# EAGLE design DAC_OutputStage 4 (EAGLE 9.6.2)
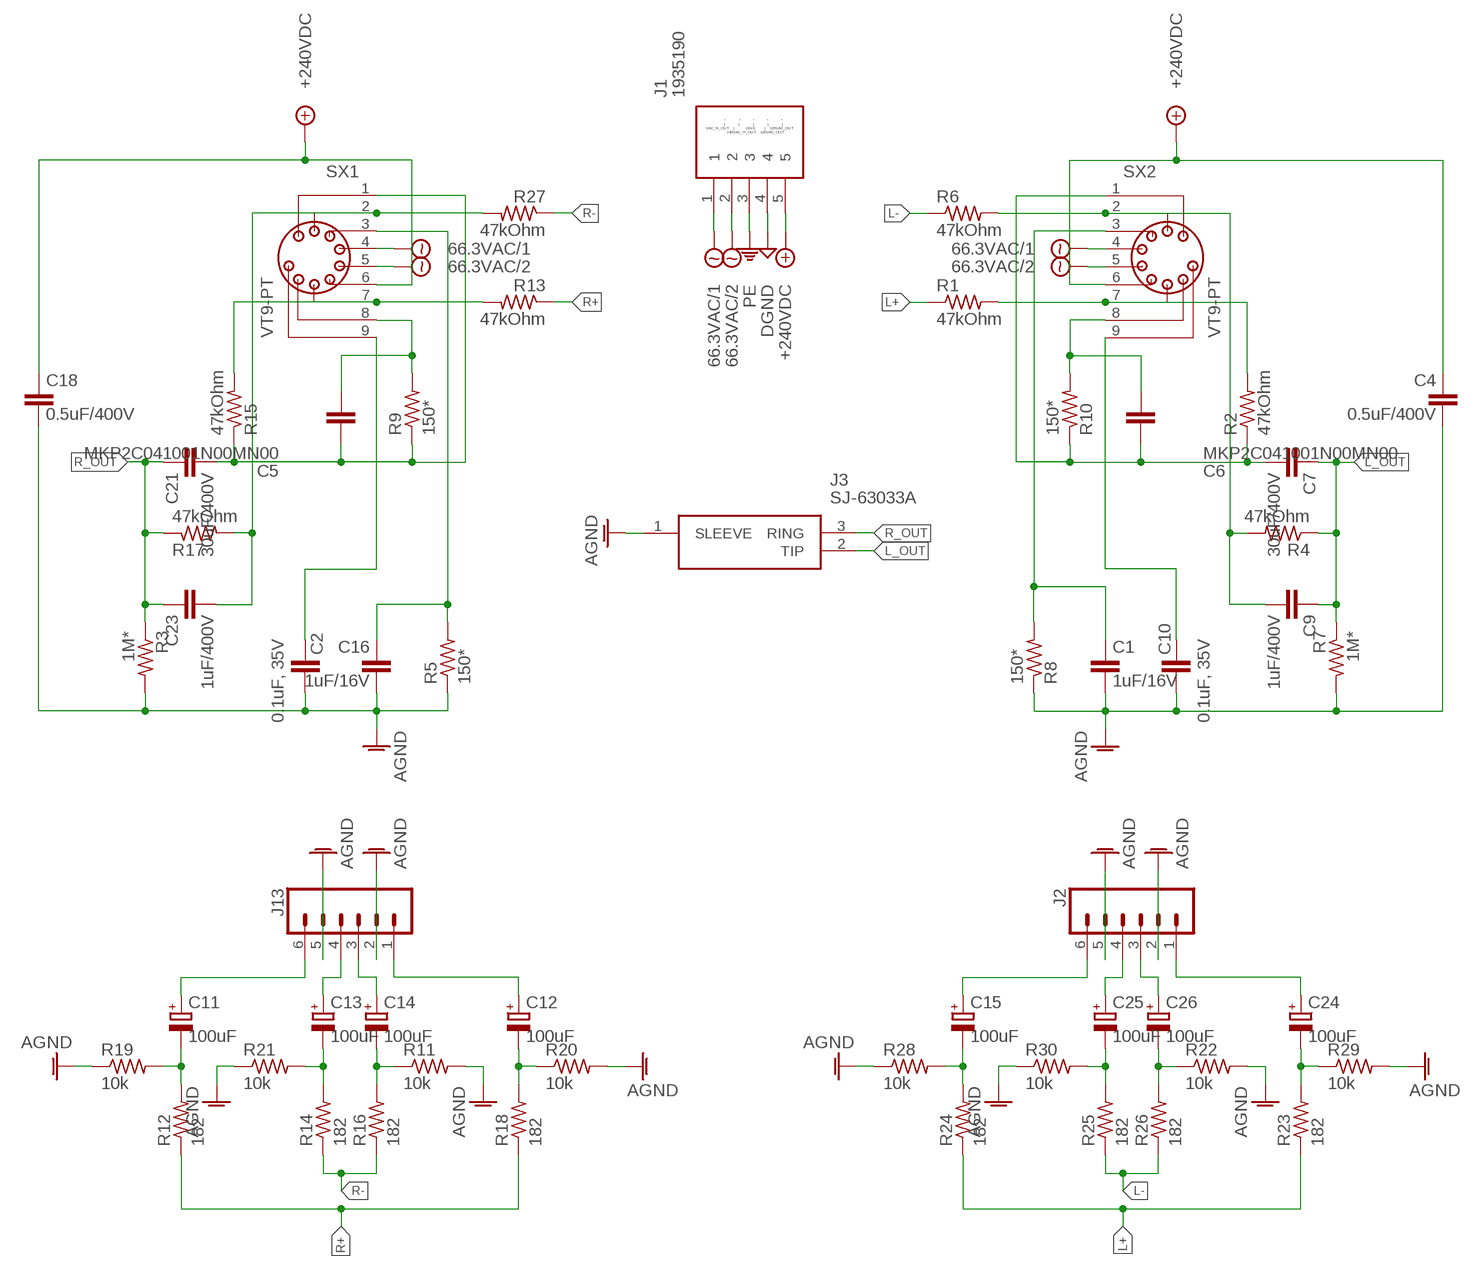
[diagram p0: schematic, sheet 1]

## Parts
C1  1uF/16V  MKP2C041001N00MN00  [MKP2C041001N00MN00]
C2  0.1uF, 35V  MKS4B031002A00JC00  [MKS4B031002A00JC00]
C4  0.5uF/400V  MKP4G034705D00KSSD  [MKP4G034705D00KSSD]
C5  MKP2C041001N00MN00  [MKP2C041001N00MN00]
C6  MKP2C041001N00MN00  [MKP2C041001N00MN00]
C7  30uF/400V  DCP4G053006ID2KSSD  [DCP4G053006ID2KSSD]
C9  1uF/400V  MKP4G041005I00JSSD  [MKP4G041005I00JSSD]
C10  0.1uF, 35V  MKS4B031002A00JC00  [MKS4B031002A00JC00]
C11  100uF  UFW1H101MPD1TD  [CAPPRD350W60D825H1300]
C12  100uF  UFW1H101MPD1TD  [CAPPRD350W60D825H1300]
C13  100uF  UFW1H101MPD1TD  [CAPPRD350W60D825H1300]
C14  100uF  UFW1H101MPD1TD  [CAPPRD350W60D825H1300]
C15  100uF  UFW1H101MPD1TD  [CAPPRD350W60D825H1300]
C16  1uF/16V  MKP2C041001N00MN00  [MKP2C041001N00MN00]
C18  0.5uF/400V  MKP4G034705D00KSSD  [MKP4G034705D00KSSD]
C21  30uF/400V  DCP4G053006ID2KSSD  [DCP4G053006ID2KSSD]
C23  1uF/400V  MKP4G041005I00JSSD  [MKP4G041005I00JSSD]
C24  100uF  UFW1H101MPD1TD  [CAPPRD350W60D825H1300]
C25  100uF  UFW1H101MPD1TD  [CAPPRD350W60D825H1300]
C26  100uF  UFW1H101MPD1TD  [CAPPRD350W60D825H1300]
J1  1935190  [1935190]
J2  CONN_06SILK_FEMALE_PTH  [1X06]
J3  SJ-63033A  [SJ63033A]
J13  CONN_06SILK_FEMALE_PTH  [1X06]
R1  47kOhm  LR1F47K  [RESAD1540W55L620D230]
R2  47kOhm  LR1F47K  [RESAD1540W55L620D230]
R3  1M*  LR1F1M0  [RESAD1540W60L620D230]
R4  47kOhm  LR1F47K  [RESAD1540W55L620D230]
R5  150*  LR1F150R  [RESAD1540W55L620D230]
R6  47kOhm  LR1F47K  [RESAD1540W55L620D230]
R7  1M*  LR1F1M0  [RESAD1540W60L620D230]
R8  150*  LR1F150R  [RESAD1540W55L620D230]
R9  150*  LR1F150R  [RESAD1540W55L620D230]
R10  150*  LR1F150R  [RESAD1540W55L620D230]
R11  10k  LR1F10K  [RESAD1540W55L620D230]
R12  182  MF0207FTE52-182R  [RESAD1590W60L630D240]
R13  47kOhm  LR1F47K  [RESAD1540W55L620D230]
R14  182  MF0207FTE52-182R  [RESAD1590W60L630D240]
R15  47kOhm  LR1F47K  [RESAD1540W55L620D230]
R16  182  MF0207FTE52-182R  [RESAD1590W60L630D240]
R17  47kOhm  LR1F47K  [RESAD1540W55L620D230]
R18  182  MF0207FTE52-182R  [RESAD1590W60L630D240]
R19  10k  LR1F10K  [RESAD1540W55L620D230]
R20  10k  LR1F10K  [RESAD1540W55L620D230]
R21  10k  LR1F10K  [RESAD1540W55L620D230]
R22  10k  LR1F10K  [RESAD1540W55L620D230]
R23  182  MF0207FTE52-182R  [RESAD1590W60L630D240]
R24  182  MF0207FTE52-182R  [RESAD1590W60L630D240]
R25  182  MF0207FTE52-182R  [RESAD1590W60L630D240]
R26  182  MF0207FTE52-182R  [RESAD1590W60L630D240]
R27  47kOhm  LR1F47K  [RESAD1540W55L620D230]
R28  10k  LR1F10K  [RESAD1540W55L620D230]
R29  10k  LR1F10K  [RESAD1540W55L620D230]
R30  10k  LR1F10K  [RESAD1540W55L620D230]
SX1  VT9-PT  [VT9-PT]
SX2  VT9-PT  [VT9-PT]

## Nets
66.3VAC/1: J1.1 SX1.4 SX2.4
66.3VAC/2: J1.2 SX1.5 SX2.5
+240VDC: C4.1 C18.1 J1.5 SX1.6 SX2.6
AGND [Power]: C1.2 C2.2 C4.2 C10.2 C16.2 C18.2 J2.2 J2.5 J3.1(SLEEVE) J13.2 J13.5 R3.2 R5.1 R7.2 R8.1 R11.2 R19.1 R20.2 R21.1 R22.2 R28.1 R29.2 R30.1
DGND: J1.4
L+: R1.1 R23.1 R24.1
L-: R6.1 R25.1 R26.1
L_OUT: C7.1 C9.1 J3.2(TIP) R4.1 R7.1
N$1: C5.2 R9.2 SX1.8
N$2: C2.1 SX1.9
N$3: R1.2 R2.2 SX2.7
N$4: C6.2 R10.2 SX2.8
N$5: C6.1 C7.2 R2.1 R10.1 SX2.1
N$7: C9.2 R4.2 R6.2 SX2.2
N$8: C1.1 R8.2 SX2.3
N$9: C10.1 SX2.9
N$10: C11.1(+) J13.6
N$11: C11.2(-) R12.2 R19.2
N$12: C15.1(+) J2.6
N$15: C12.1(+) J13.1
N$16: R13.2 R15.2 SX1.7
N$18: C5.1 C21.2 R9.1 R15.1 SX1.1
N$19: C12.2(-) R18.2 R20.1
N$20: C15.2(-) R24.2 R28.2
N$21: C13.1(+) J13.4
N$23: C23.2 R17.2 R27.2 SX1.2
N$24: C14.1(+) J13.3
N$25: C14.2(-) R11.1 R16.2
N$26: C16.1 R5.2 SX1.3
N$28: C13.2(-) R14.2 R21.2
N$30: C24.1(+) J2.1
N$31: C24.2(-) R23.2 R29.1
N$32: C25.1(+) J2.4
N$33: C26.1(+) J2.3
N$34: C26.2(-) R22.1 R26.2
N$36: C25.2(-) R25.2 R30.2
PE: J1.3
R+: R12.1 R13.1 R18.1
R-: R14.1 R16.1 R27.1
R_OUT: C21.1 C23.1 J3.3(RING) R3.1 R17.1

## Notes on the sheet
- ^             ^            ^            ^            ^
          |             |             |             |             |
  VAC_N_OUT    |           GND         |    126VAC_OUT
              240VAC_H_OUT    126VAC_OUT

## Library data of the parts
C1 C5 C6 C16 = Dual Mono Amp Library:MKP2C041001N00MN00: Film Capacitors MKP 2 1.0 uF 63 VDC 11x16x7.2 PCM 5 Source: Datasheet; DESCRIPTION: Film Capacitors MKP 2 1.0 uF 63 VDC 11x16x7.2 PCM 5; HEIGHT: 16mm; MANUFACTURER_NAME: WIMA; MANUFACTURER_PART_NUMBER: MKP2C041001N00MN00; MOUSER_PART_NUMBER: 505-MKP2C0411NMN; MOUSER_PRICE-STOCK: https://www.mouser.co.uk/ProductDetail/WIMA/MKP2C041001N00MN00?qs=RB4whv9F6rzjnMhXY4f0hA%3D%3D
C2 C10 = Dual Mono Amp Library:MKS4B031002A00JC00: Film Capacitors MKS 4 0.1 uF 50 VDC 2.5x7x10 PCM 7.5 Source: Datasheet <https://www.wima.de/wp-content/uploads/media/e_WIMA_MKS_4.pdf>; DESCRIPTION: Film Capacitors MKS 4 0.1 uF 50 VDC 2.5x7x10 PCM 7.5; HEIGHT: 7mm; MANUFACTURER_NAME: WIMA; MANUFACTURER_PART_NUMBER: MKS4B031002A00JC00; MOUSER_PART_NUMBER: 505-MKS4B0312AJC; MOUSER_PRICE-STOCK: https://www.mouser.co.uk/ProductDetail/WIMA/MKS4B031002A00JC00?qs=2G4irm%2FqADy9MV8AUfKNYA%3D%3D
C4 C18 = Dual Mono Amp Library:MKP4G034705D00KSSD: 0.47 F Film Capacitor 220V 400V Polypropylene (PP), Metallized Radial Source: Datasheet <https://www.wima.de/wp-content/uploads/media/e_WIMA_MKP_4.pdf>; DESCRIPTION: 0.47 F Film Capacitor 220V 400V Polypropylene (PP), Metallized Radial; HEIGHT: 16.5mm; MANUFACTURER_NAME: WIMA; MANUFACTURER_PART_NUMBER: MKP4G034705D00KSSD; MOUSER_PART_NUMBER: 505-MKP4G034705DKSSD; MOUSER_PRICE-STOCK: http://www.mouser.com/Search/ProductDetail.aspx?qs=sJjjjplDs9uaOctv9bTMfA%3d%3d
C7 C21 = Dual Mono Amp Library:DCP4G053006ID2KSSD: Film Capacitors DC-LINK MKP 4 30.0 uF 400 VDC 17x34.5x31.5 PCM 27.5 Source: Datasheet <https://www.wima.de/wp-content/uploads/media/e_WIMA_DC_Link_MKP_4.pdf>; DESCRIPTION: Film Capacitors DC-LINK MKP 4 30.0 uF 400 VDC 17x34.5x31.5 PCM 27.5; HEIGHT: 34.5mm; MANUFACTURER_NAME: WIMA; MANUFACTURER_PART_NUMBER: DCP4G053006ID2KSSD; MOUSER_PART_NUMBER: 505-DCP4G0536ID2KSSD; MOUSER_PRICE-STOCK: https://www.mouser.co.uk/ProductDetail/WIMA/DCP4G053006ID2KSSD?qs=RB4whv9F6rwxZ2Ey0tRejg%3D%3D
C9 C23 = Dual Mono Amp Library:MKP4G041005I00JSSD: Film Capacitors 1uF 400 Volts 5% Source: Datasheet <https://www.wima.de/wp-content/uploads/media/e_WIMA_MKP_4.pdf>; DESCRIPTION: Film Capacitors 1uF 400 Volts 5%; HEIGHT: 21mm; MANUFACTURER_NAME: WIMA; MANUFACTURER_PART_NUMBER: MKP4G041005I00JSSD; MOUSER_PART_NUMBER: 505-MKP4G041005I00JS; MOUSER_PRICE-STOCK: https://www.mouser.co.uk/ProductDetail/WIMA/MKP4G041005I00JSSD?qs=JZ%252BiKJYxjZXJVyWNRtSklQ%3D%3D
C11-C15 C24-C26 = Dual Mono Amp Library:UFW1H101MPD1TD: Aluminum Electrolytic Capacitors - Radial Leaded 100uF 50 Volts 20% Source: Datasheet <https://www.nichicon.co.jp/english/series_items/catalog_pdf/e-ufw.pdf>; ARROW_PART_NUMBER: UFW1H101MPD1TD; ARROW_PRICE-STOCK: https://www.arrow.com/en/products/ufw1h101mpd1td/nichicon; DESCRIPTION: Aluminum Electrolytic Capacitors - Radial Leaded 100uF 50 Volts 20%; HEIGHT: 13mm; MANUFACTURER_NAME: Nichicon; MANUFACTURER_PART_NUMBER: UFW1H101MPD1TD; MOUSER_PART_NUMBER: 647-UFW1H101MPD1TD; MOUSER_PRICE-STOCK: https://www.mouser.co.uk/ProductDetail/Nichicon/UFW1H101MPD1TD?qs=WJSLByB5Mu30jPPJ2KiG3A%3D%3D
J1 = Dual Mono Amp Library:1935190: PCB terminal block, nominal current: 17.5 A, rated voltage (III/2): 400 V, nominal cross section: 1.5 mm?, Number of potentials: 5, Number of rows: 1, Number of positions per row: 5, product range: PT 1,5/..-H, pitch: 5 mm, connection method: Screw connection with wire protector, mounting: Wave soldering, conductor/PCB connection direction: 0 ?, color: green, Pin layout: Linear pinning, Solder pin [P]: 3.5 mm, type of packaging: packed in cardboard Source: Datasheet <https://www.phoenixcontact.com/online/portal/us/pxc/product_detail_page/!ut/p/z1/3Vdbc5pAFP4r5sG3rLsLLEJn-oDGlJjEYsQqvDDssma24RZETf31Xbyk1Wn1IeN0CnNm2D2c853L8jEc6MMp9NNwKZ7DUmRpGMu95-uB23F7PUfR8dch6aC7G9LtPWhP2B4o8Bv0oV-GFHq4WsWCFmHxA3qLOU8rRS4i-chUCTZRtc>; DESCRIPTION: PCB terminal block, nominal current: 17.5 A, rated voltage (III/2): 400 V, nominal cross section: 1.5 mm?, Number of potentials: 5, Number of rows: 1, Number of positions per row: 5, product range: PT 1,5/..-H, pitch: 5 mm, connection method: Screw connection with wire protector, mounting: Wave soldering, conductor/PCB connection direction: 0 ?, color: green, Pin layout: Linear pinning, Solder pin [P]: 3.5 mm, type of packaging: packed in cardboard; HEIGHT: 11.55mm; MANUFACTURER_NAME: Phoenix Contact; MANUFACTURER_PART_NUMBER: 1935190; MOUSER_PART_NUMBER: 651-1935190; MOUSER_PRICE-STOCK: https://www.mouser.co.uk/ProductDetail/Phoenix-Contact/1935190?qs=QWULklcAmSS%2FS46GSzyZOw%3D%3D
J2 J13 = Dual Mono Amp Library:CONN_06: Multi connection point. Often used as Generic Header-pin footprint for 0.1 inch spaced/style header connections On any of the 0.1 inch spaced packages, you can populate with these: Break Away Headers - Straight <https://www.sparkfun.com/products/116> (PRT-00116) Break Away Male Headers - Right Angle <https://www.sparkfun.com/products/553> (PRT-00553) Female Headers <https://www.sparkfun.com/products/115> (PRT-00115) Break Away Headers - Machine Pin <https://www.sparkfun.com/products/117> (PRT-00117) Break Away Female Headers - Swiss Machine Pin <https://www.sparkfun.com/products/743> (PRT-00743) Arduino Stackable Header - 6 Pin <https://www.sparkfun.com/products/9280> (PRT-09280) Screw Terminals 2.54mm Pitch (6-Pin) <https://www.sparkfun.com/products/16499> (PRT-16499) For SCREWTERMINALS and SPRING TERMINALS visit here: Screw Terimnals on SparkFun.com <https://www.sparkfun.com/search/results?term=Screw+Terminals> (5mm/3.5mm/2.54mm spacing) This device is also useful as a general connection point to wire up your design to another part of your project. Our various solder wires solder well into these plated through hole pads. Hook-Up Wire - Assortment (Stranded, 22 AWG) <https://www.sparkfun.com/products/11375> (PRT-11375) Hook-Up Wire - Assortment (Solid Core, 22 AWG) <https://www.sparkfun.com/products/11367> (PRT-11367) View the entire wire category on our website here <https://www.sparkfun.com/categories/141>; PROD_ID: CONN-08437
J3 = Dual Mono Amp Library:SJ-63033A: 6.35 mm, Stereo, Right Angle, Through Hole Mount, 3 Conductors, 0 Internal Switches, Audio Jack Connector Source: Datasheet <https://www.cuidevices.com/product/resource/sj-63033a.pdf>; DESCRIPTION: 6.35 mm, Stereo, Right Angle, Through Hole Mount, 3 Conductors, 0 Internal Switches, Audio Jack Connector; HEIGHT: 12.3mm; MANUFACTURER_NAME: CUI Devices; MANUFACTURER_PART_NUMBER: SJ-63033A
R1 R2 R4 R6 R13 R15 R17 R27 = Dual Mono Amp Library:LR1F47K: TE Connectivity LR1F Series Axial Metal Film Resistor 47k +/-1% 0.6W +/-50ppm/C Source: Datasheet <https://componentsearchengine.com/Datasheets/2/LR1F47K.pdf>; DESCRIPTION: TE Connectivity LR1F Series Axial Metal Film Resistor 47k +/-1% 0.6W +/-50ppm/C; HEIGHT: mm; MANUFACTURER_NAME: TE Connectivity; MANUFACTURER_PART_NUMBER: LR1F47K; MOUSER_PART_NUMBER: 279-LR1F47K; MOUSER_PRICE-STOCK: https://www.mouser.co.uk/ProductDetail/TE-Connectivity-Holsworthy/LR1F47K?qs=ip69W3eHERWQ8q3y81tH5w%3D%3D
R3 R7 = Dual Mono Amp Library:LR1F1M0: TE Connectivity Axial Metal Film Resistor 1m +/-1% 0.6W +/-50ppm/C Source: Datasheet <https://www.te.com/commerce/DocumentDelivery/DDEController?Action=showdoc&DocId=Data Sheet1773241GpdfEnglishENG_DS_1773241_G.pdf1622367-1>; DESCRIPTION: TE Connectivity Axial Metal Film Resistor 1m +/-1% 0.6W +/-50ppm/C; HEIGHT: mm; MANUFACTURER_NAME: TE Connectivity; MANUFACTURER_PART_NUMBER: LR1F1M0; MOUSER_PART_NUMBER: 279-LR1F1M0; MOUSER_PRICE-STOCK: https://www.mouser.co.uk/ProductDetail/TE-Connectivity-Holsworthy/LR1F1M0?qs=ip69W3eHERVt%2FmQVAugcSg%3D%3D
R5 R8-R10 = Dual Mono Amp Library:LR1F150R: TE Connectivity LR1F Series Axial Metal Film Resistor 150 +/-1% 0.6W +/-50ppm/C Source: Datasheet <https://datasheet.datasheetarchive.com/originals/distributors/DKDS-21/401716.pdf>; DESCRIPTION: TE Connectivity LR1F Series Axial Metal Film Resistor 150 +/-1% 0.6W +/-50ppm/C; HEIGHT: mm; MANUFACTURER_NAME: TE Connectivity; MANUFACTURER_PART_NUMBER: LR1F150R
R11 R19-R22 R28-R30 = Dual Mono Amp Library:LR1F10K: Metal film resistor, 10K 0.6W TE Connectivity LR1F Series Axial Metal Film Resistor 10k Source: Datasheet <https://datasheet.datasheetarchive.com/originals/distributors/DKDS-21/401716.pdf>; DESCRIPTION: Metal film resistor, 10K 0.6W TE Connectivity LR1F Series Axial Metal Film Resistor 10k; HEIGHT: mm; MANUFACTURER_NAME: TE Connectivity; MANUFACTURER_PART_NUMBER: LR1F10K; MOUSER_PART_NUMBER: 279-LR1F10K; MOUSER_PRICE-STOCK: https://www.mouser.co.uk/ProductDetail/TE-Connectivity-Holsworthy/LR1F10K?qs=ip69W3eHERWDLLWs2Qv0Lg%3D%3D
R12 R14 R16 R18 R23-R26 = Dual Mono Amp Library:MF0207FTE52-182R: Metal Film Resistors - Through Hole 0.6W 1% 182 ohm 50pp m Source: Datasheet <https://www.mouser.com/datasheet/2/447/YAGEO_MF0_datasheet_2021v1-3003020.pdf>; DESCRIPTION: Metal Film Resistors - Through Hole 0.6W 1% 182 ohm 50pp m; HEIGHT: mm; MANUFACTURER_NAME: YAGEO; MANUFACTURER_PART_NUMBER: MF0207FTE52-182R
SX1 SX2 = Dual Mono Amp Library:VT9: VACUUM TUBE SOCKET Source: 00004280-VT9-PT.pdf

## Net classes
3 Power: width 1.27 mm, drill 1.27 mm, clearance 0.254 mm

## Board
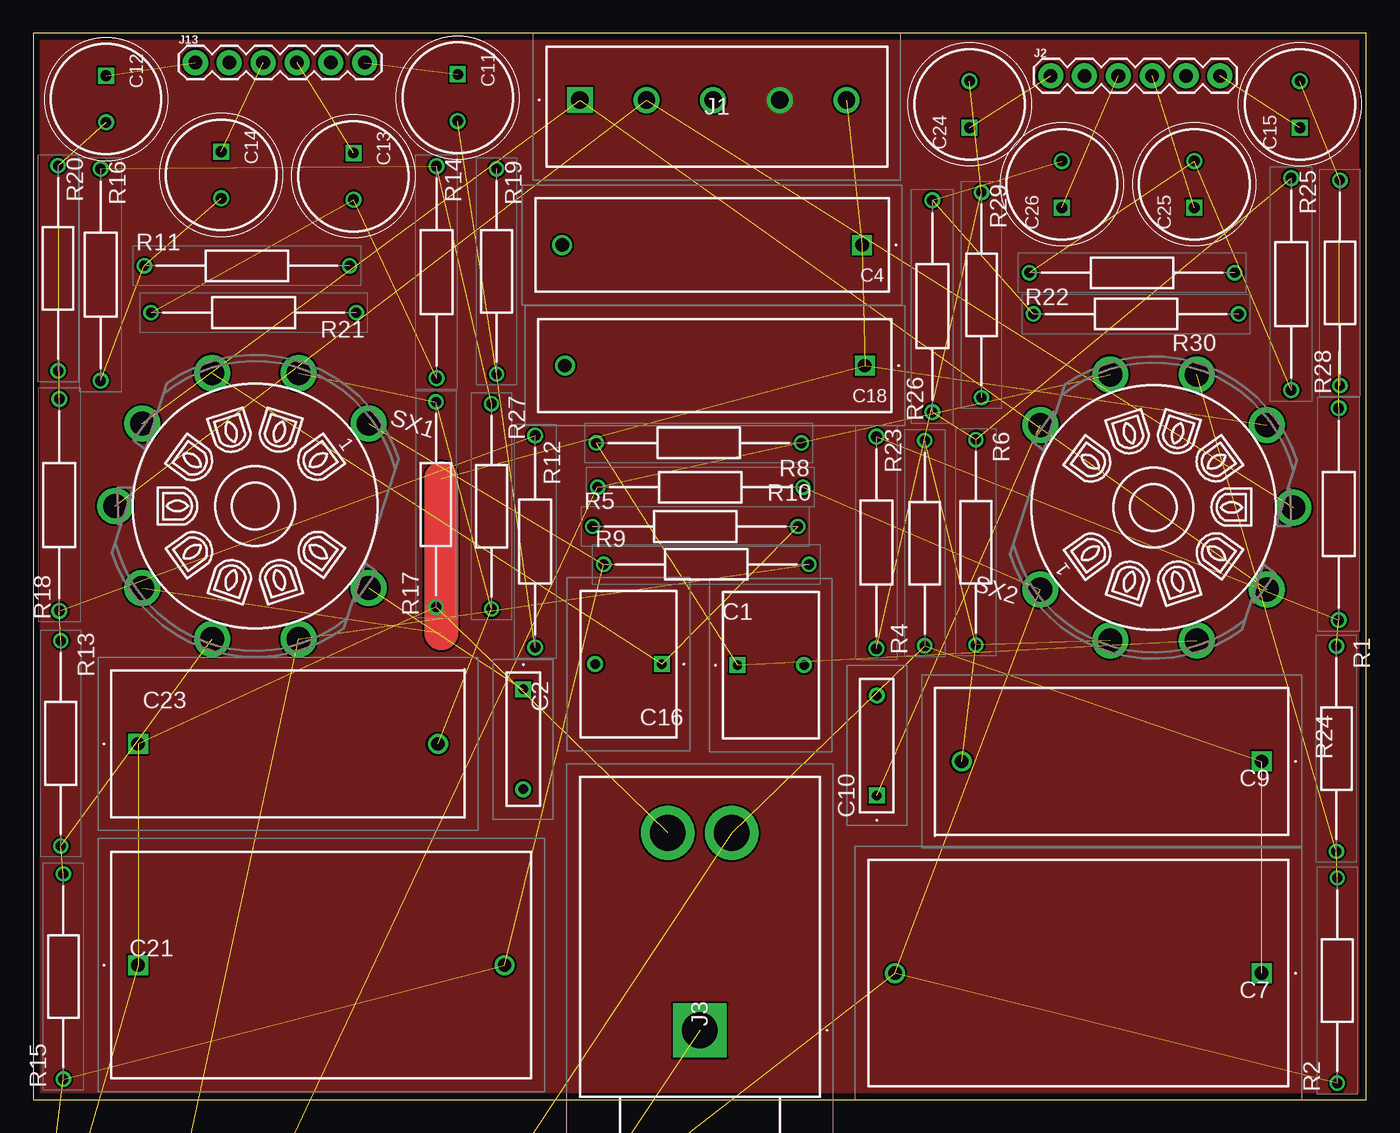
[diagram p1: board, top side]
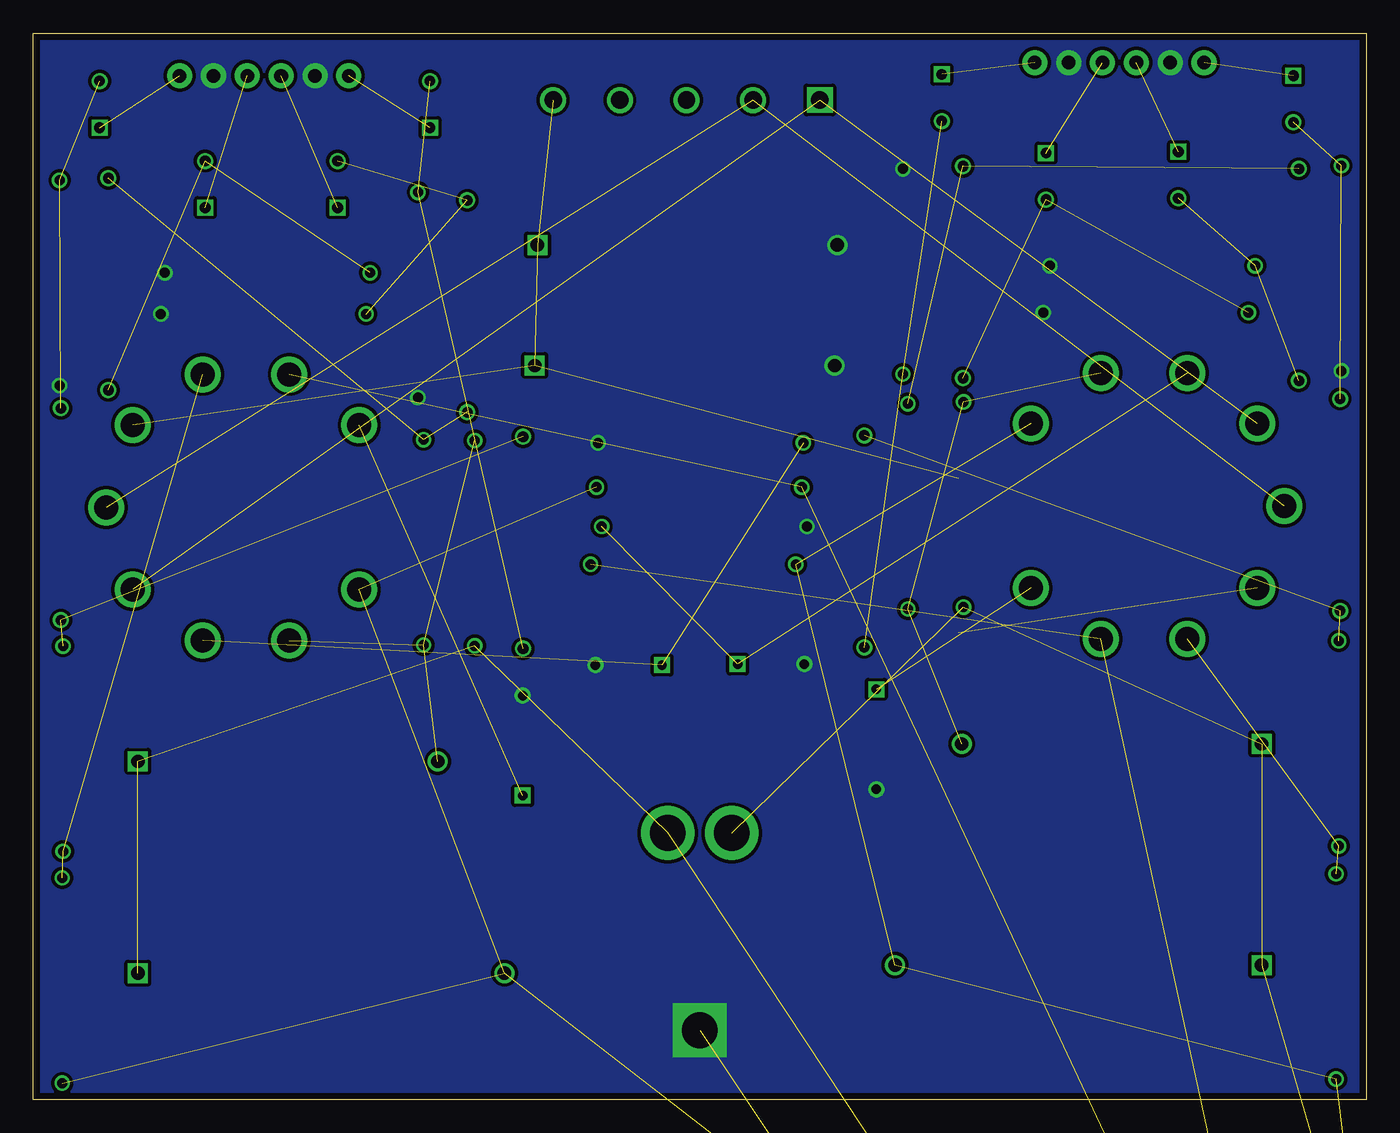
[diagram p2: board, bottom side, seen from below]

Size 100 x 80 mm. Coordinates in mm from the lower left corner, seen from the top.
Outline: 0,0 100,0 100,80 0,80 0,0
Copper layers (1*16): Top 0.035mm / dielectric 1.6mm / Bottom 0.035mm
Design rules "Elecrow_2-layer_PCB_eagle_rule": minimum track width 6mil, minimum drill 12mil, track to track 6mil, track to pad 6mil, pad to pad 6mil, via to via 8mil, smd to smd 0mil, copper to edge 20mil, drill to drill 10mil, minimum pad ring 6mil, minimum via ring 6mil, stop-mask expansion 0mil, vias tented up to drill 100mil, thermal gap 10mil

### Footprints (pad centres in the part's own frame; a part is rotated, then mirrored left to right if it is on the bottom)
MKP2C041001N00MN00 = drill 0.7 pad 1.2 square: 1 0,0 | drill 0.7 pad 1.2: 2 5,0
MKS4B031002A00JC00 = drill 0.7 pad 1.2 square: 1 0,0 | drill 0.7 pad 1.2: 2 7.5,0
MKP4G034705D00KSSD = drill 1 pad 1.5 square: 1 0,0 | drill 1 pad 1.5: 2 22.5,0
DCP4G053006ID2KSSD = drill 1 pad 1.5 square: 1 0,0 | drill 1 pad 1.5: 2 27.5,0
MKP4G041005I00JSSD = drill 1 pad 1.5 square: 1 0,0 | drill 1 pad 1.5: 2 22.5,0
CAPPRD350W60D825H1300 = drill 0.8 pad 1.2 square: 1 0,0 | drill 0.8 pad 1.2: 2 3.5,0
1935190 = drill 1.3 pad 1.95 square: 1 0,0 | drill 1.3 pad 1.95: 2 5,0; 3 10,0; 4 15,0; 5 20,0
1X06 = drill 1.016 pad 1.88: 1 0,0; 2 2.54,0; 3 5.08,0; 4 7.62,0; 5 10.16,0; 6 12.7,0
SJ63033A = drill 2.69 pad 4.035 square: 1 0,0 | drill 2.69 pad 4.035: 2 14.8,-2.4; 3 14.8,2.4
RESAD1540W55L620D230 = drill 0.75 pad 1.15: 1 0,0; 2 15.4,0
RESAD1540W60L620D230 = drill 0.8 pad 1.2: 1 0,0; 2 15.4,0
RESAD1590W60L630D240 = drill 0.8 pad 1.2: 1 0,0; 2 15.9,0
VT9-PT = drill 1.8 pad 2.4: 1 6.172,8.495; 2 0,10.5; 3 -6.172,8.495; 4 -9.986,3.245; 5 -9.986,-3.245; 6 -6.172,-8.495; 7 0,-10.5; 8 6.172,-8.495; 9 9.986,-3.244

### Placement (x,y rotation side)
C1  52.83,32.59 0 top
C2  36.76,30.79 270 top
C4  62.18,64.12 180 top
C5  -5,-57.15 0 top  (outside the outline)
C6  -5,-44.45 0 top  (outside the outline)
C7  92.15,9.48 180 top
C9  92.15,25.37 180 top
C10  63.28,22.8 90 top
C11  31.84,76.92 270 top
C12  5.46,76.82 270 top
C13  24.02,71.02 270 top
C14  14.09,71.12 270 top
C15  95.03,72.92 90 top
C16  47.16,32.67 180 top
C18  62.38,55.07 180 top
C21  7.85,10.08 0 top
C23  7.85,26.69 0 top
C24  70.25,72.92 90 top
C25  87.1,66.92 90 top
C26  77.17,66.92 90 top
J1  41,75 0 top
J2  76.33,76.81 0 top
J3  50,5.2 90 top
J13  12.16,77.81 0 top
R1  97.77,34.02 270 top
R2  97.83,1.23 90 top
R3  -15.4,-69.85 0 top  (outside the outline)
R4  66.88,34.05 90 top
R5  41.96,43 0 top
R6  70.72,49.51 270 top
R7  -15.4,-82.55 0 top  (outside the outline)
R8  57.63,49.26 180 top
R9  42.79,40.15 0 top
R10  57.75,45.94 180 top
R11  8.33,62.56 0 top
R12  37.66,49.83 270 top
R13  2.06,34.42 270 top
R14  30.25,70.03 270 top
R15  2.26,1.53 90 top
R16  5.05,69.83 270 top
R17  30.21,36.95 90 top
R18  1.96,36.67 90 top
R19  34.75,69.83 270 top
R20  1.86,70.07 270 top
R21  24.23,59.05 180 top
R22  75.03,58.94 0 top
R23  63.25,49.73 270 top
R24  97.93,35.97 90 top
R25  94.36,69.13 270 top
R26  67.44,51.57 90 top
R27  34.38,52.2 270 top
R28  98.03,53.57 90 top
R29  71.15,68.07 270 top
R30  90.13,62.03 180 top
SX1  16.65,44.54 342 top
SX2  84.04,44.43 162 top

### Tracks (layer width: path | path; a pad name or v marks a point on that pad's centre or on a via)
66.3VAC/1  (2 unrouted)
66.3VAC/2  (2 unrouted)
+240VDC  (5 unrouted)
  Top 2.54: 30.6,46.6 30.6,35
AGND  (2 unrouted)
  pour Bottom (rank 6, no thermals): 0,0 0,80 100,80 100,0
DGND
  pour Top (rank 6, no thermals): 0,0 0,80 100,80 100,0
L+  (2 unrouted)
L-  (2 unrouted)
L_OUT  (4 unrouted)
N$1  (2 unrouted)
N$2  (1 unrouted)
N$3  (2 unrouted)
N$4  (2 unrouted)
N$5  (4 unrouted)
N$7  (3 unrouted)
N$8  (2 unrouted)
N$9  (1 unrouted)
N$10  (1 unrouted)
N$11  (2 unrouted)
N$12  (1 unrouted)
N$15  (1 unrouted)
N$16  (2 unrouted)
N$18  (4 unrouted)
N$19  (2 unrouted)
N$20  (2 unrouted)
N$21  (1 unrouted)
N$23  (3 unrouted)
N$24  (1 unrouted)
N$25  (2 unrouted)
N$26  (2 unrouted)
N$28  (2 unrouted)
N$30  (1 unrouted)
N$31  (2 unrouted)
N$32  (1 unrouted)
N$33  (1 unrouted)
N$34  (2 unrouted)
N$36  (2 unrouted)
R+  (2 unrouted)
R-  (2 unrouted)
R_OUT  (4 unrouted)